# EAGLE design spi-breakout-v01 (EAGLE 7.7.0)
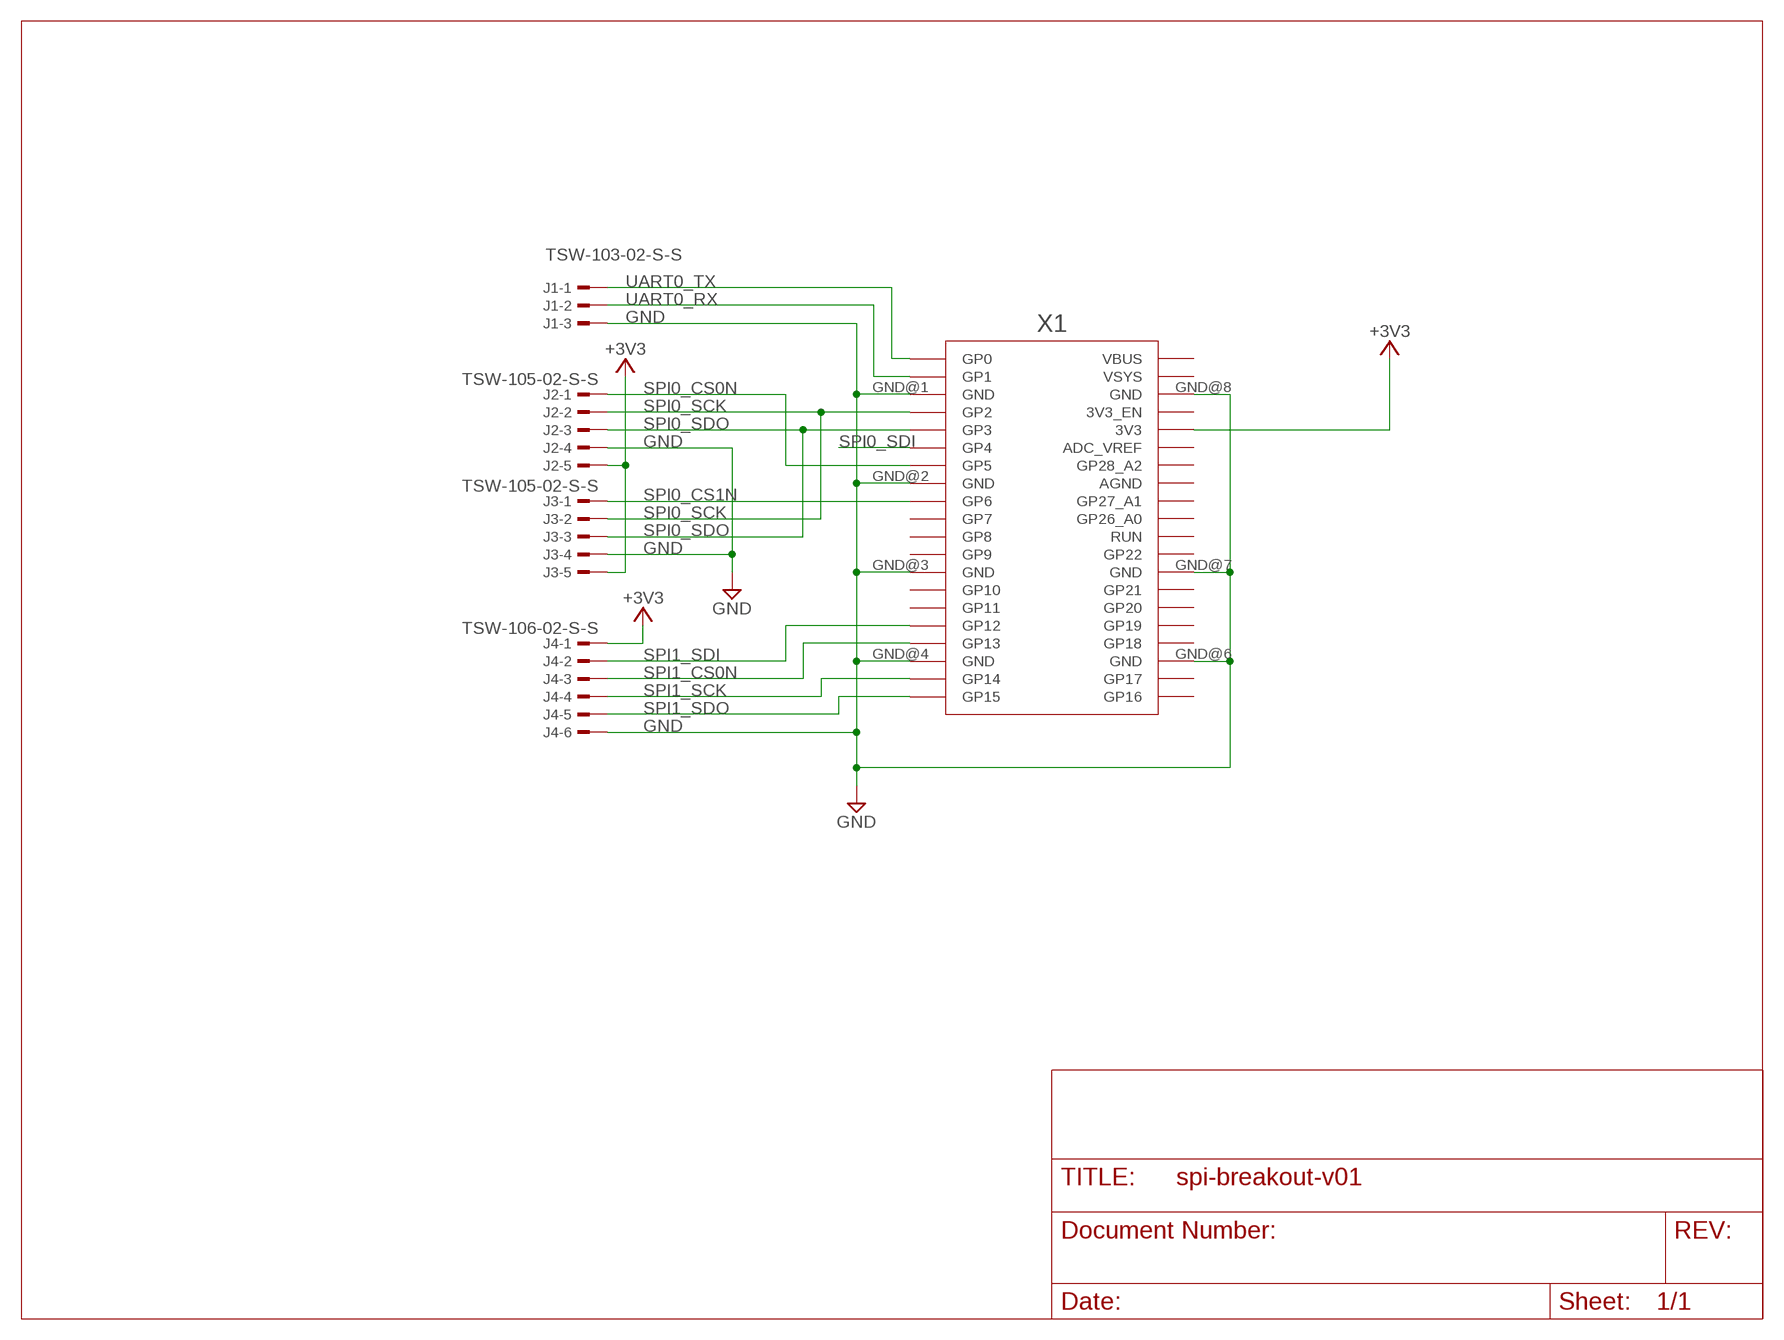
[diagram p0: schematic, sheet 1]

## Parts
J1  TSW-103-02-S-S  [TSW-103-02-S-S]
J2  TSW-105-02-S-S  [TSW-105-02-S-S]
J3  TSW-105-02-S-S  [TSW-105-02-S-S]
J4  TSW-106-02-S-S  [TSW-106-02-S-S]
X1  RPI_PICO_IG-TH  [RPI_PICO_TH]

## Nets
+3V3: J2.5 J3.5 J4.1 X1.3V3
GND: J1.3 J2.4 J3.4 J4.6 X1.GND@1(GND) X1.GND@2(GND) X1.GND@3(GND) X1.GND@4(GND) X1.GND@6(GND) X1.GND@7(GND) X1.GND@8(GND)
SPI0_CS0N: J2.1 X1.GP5
SPI0_CS1N: J3.1 X1.GP6
SPI0_SCK: J2.2 J3.2 X1.GP2
SPI0_SDI: X1.GP4
SPI0_SDO: J2.3 J3.3 X1.GP3
SPI1_CS0N: J4.3 X1.GP13
SPI1_SCK: J4.4 X1.GP14
SPI1_SDI: J4.2 X1.GP12
SPI1_SDO: J4.5 X1.GP15
UART0_RX: J1.2 X1.GP1
UART0_TX: J1.1 X1.GP0
Unconnected: X1.3V3_EN X1.ADC_VREF X1.AGND X1.GP7 X1.GP8 X1.GP9 X1.GP10 X1.GP11 X1.GP16 X1.GP17 X1.GP18 X1.GP19 X1.GP20 X1.GP21 X1.GP22 X1.GP26_A0 X1.GP27_A1 X1.GP28_A2 X1.RUN X1.VBUS X1.VSYS

## Library data of the parts
J1 = con-samtec:TSW-103-02-S-S: THROUGH-HOLE .025" SQ POST HEADER Source: Samtec TSW.pdf; OC_FARNELL: unknown; OC_NEWARK: unknown
J2 J3 = con-samtec:TSW-105-02-S-S: THROUGH-HOLE .025" SQ POST HEADER Source: Samtec TSW.pdf; OC_FARNELL: unknown; OC_NEWARK: unknown
J4 = con-samtec:TSW-106-02-S-S: THROUGH-HOLE .025" SQ POST HEADER Source: Samtec TSW.pdf; OC_FARNELL: unknown; OC_NEWARK: unknown
X1 = RaspberryPi_Pico:RPI_PICO_IG

## Board
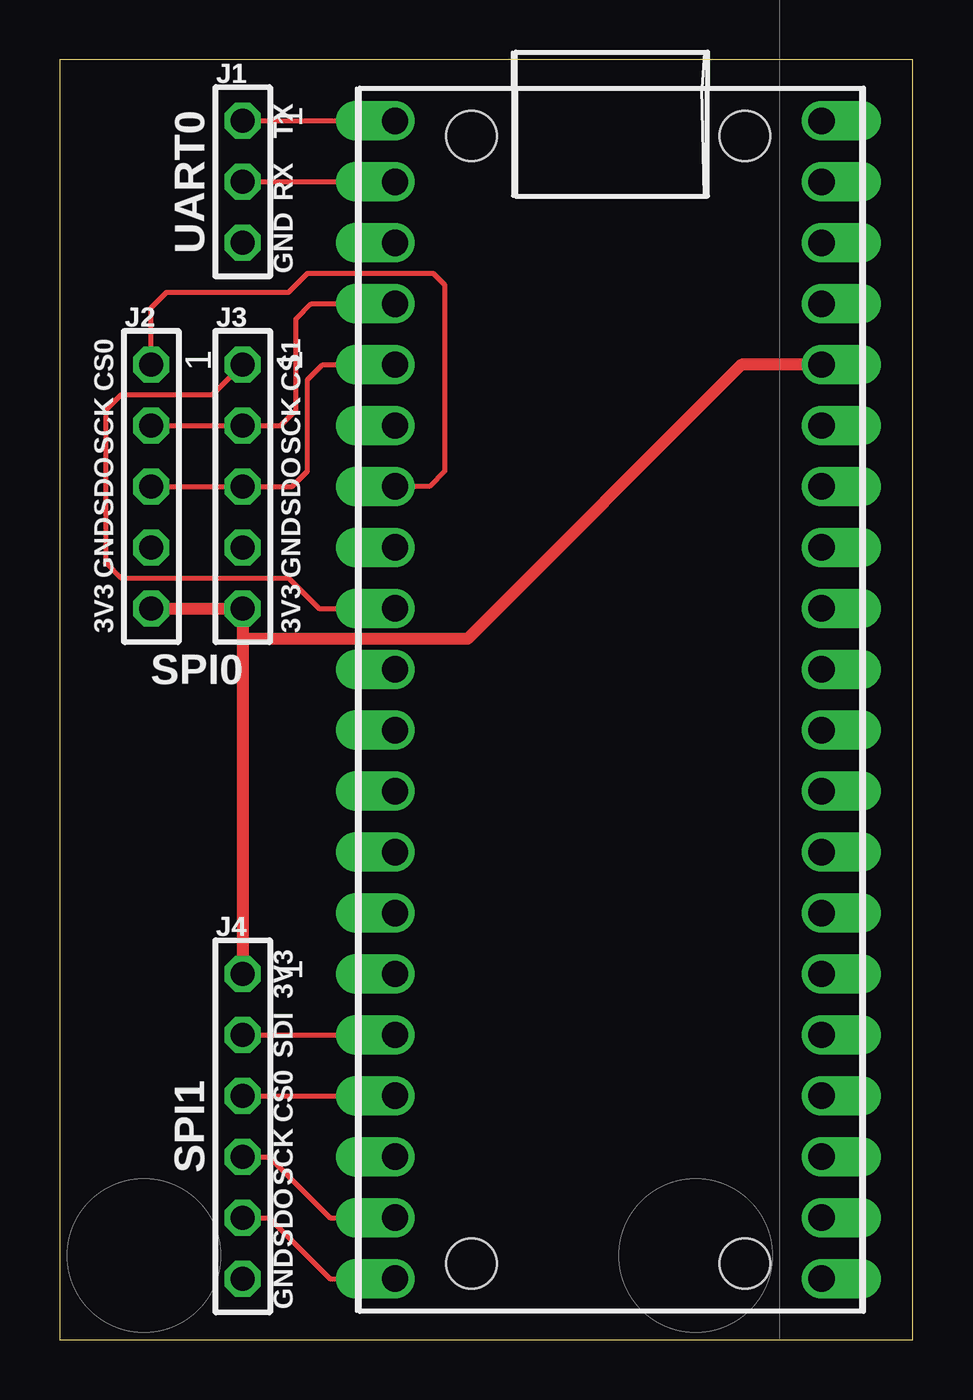
[diagram p1: board, top side]
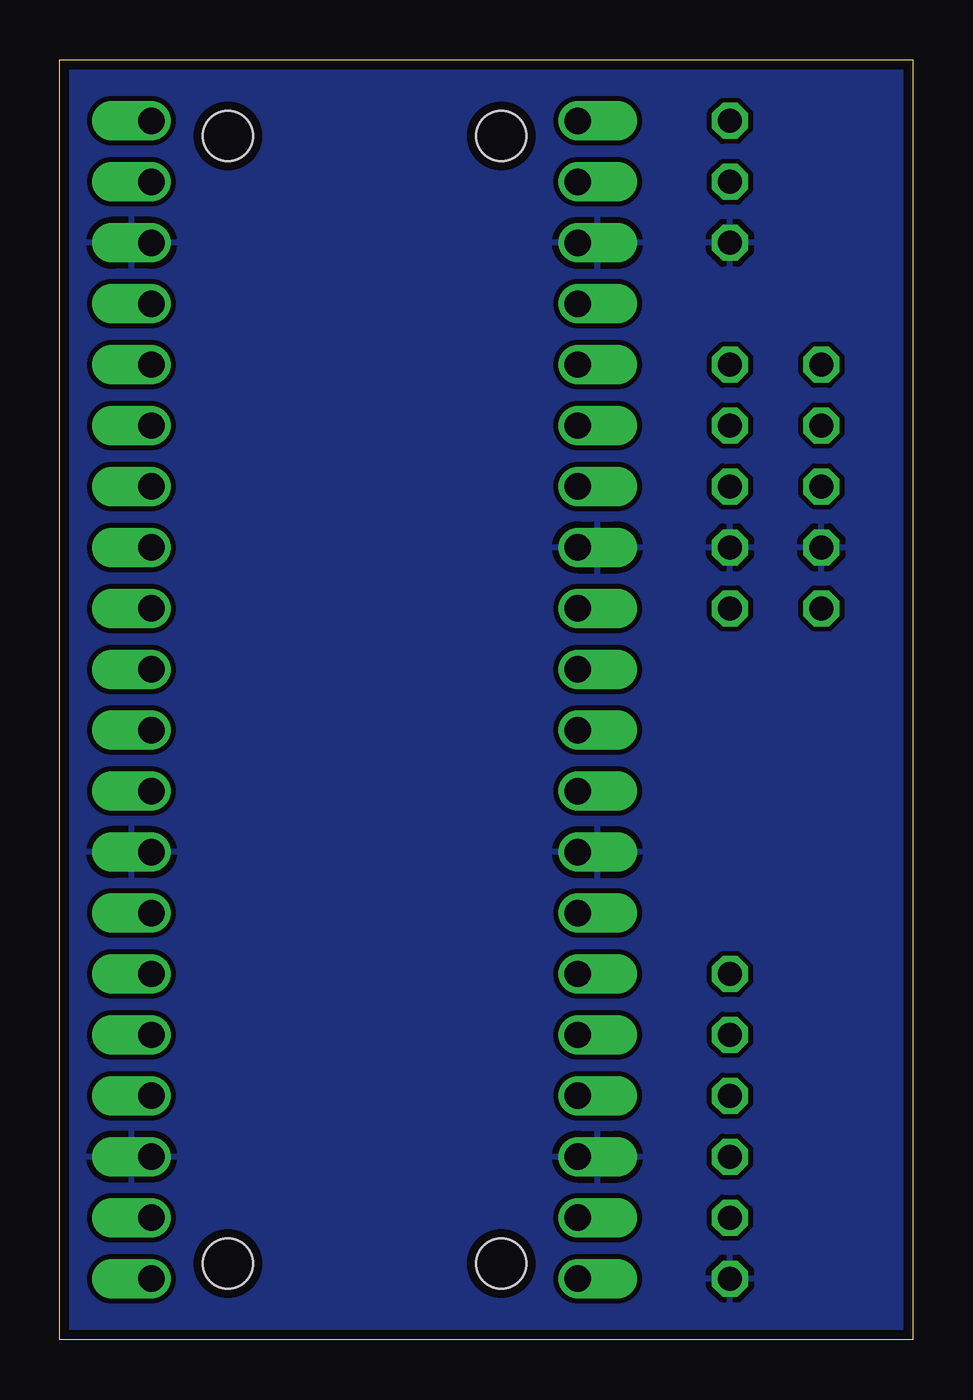
[diagram p2: board, bottom side, seen from below]

Size 35.56 x 53.34 mm. Coordinates in mm from the lower left corner, seen from the top.
Outline: 0,0 35.56,0 35.56,53.34 0,53.34 0,0
Copper layers (1*16): Top 0.035559375mm / dielectric 1.6mm / Bottom 0.035559375mm
Design rules "oshpark-2layer-2018": minimum track width 6mil, minimum drill 10mil, track to track 6mil, track to pad 6mil, pad to pad 6mil, via to via 6mil, smd to smd 6mil, copper to edge 15mil, drill to drill 6mil, minimum pad ring 5mil, minimum via ring 5mil, stop-mask expansion 2.5mil, vias tented up to drill 0mil, thermal gap 10mil

### Footprints (pad centres in the part's own frame; a part is rotated, then mirrored left to right if it is on the bottom)
TSW-103-02-S-S = drill 1 pad 1.5 octagon: 1 2.54,0; 2 0,0; 3 -2.54,0
TSW-105-02-S-S = drill 1 pad 1.5 octagon: 1 5.08,0; 2 2.54,0; 3 0,0; 4 -2.54,0; 5 -5.08,0
TSW-106-02-S-S = drill 1 pad 1.5 octagon: 1 6.35,0; 2 3.81,0; 3 1.27,0; 4 -1.27,0; 5 -3.81,0; 6 -6.35,0
RPI_PICO_TH = drill 1.1 pad 1.6 offset: 3V3 8.89,13.97; 3V3_EN 8.89,16.51; ADC_VREF 8.89,11.43; AGND 8.89,6.35; GND@1 -8.89,19.05; GND@2 -8.89,6.35; GND@3 -8.89,-6.35; GND@4 -8.89,-19.05; GND@6 8.89,-19.05; GND@7 8.89,-6.35; GND@8 8.89,19.05; GP0 -8.89,24.13; GP1 -8.89,21.59; GP2 -8.89,16.51; GP3 -8.89,13.97; GP4 -8.89,11.43; GP5 -8.89,8.89; GP6 -8.89,3.81; GP7 -8.89,1.27; GP8 -8.89,-1.27; GP9 -8.89,-3.81; GP10 -8.89,-8.89; GP11 -8.89,-11.43; GP12 -8.89,-13.97; GP13 -8.89,-16.51; GP14 -8.89,-21.59; GP15 -8.89,-24.13; GP16 8.89,-24.13; GP17 8.89,-21.59; GP18 8.89,-16.51; GP19 8.89,-13.97; GP20 8.89,-11.43; GP21 8.89,-8.89; GP22 8.89,-3.81; GP26_A0 8.89,1.27; GP27_A1 8.89,3.81; GP28_A2 8.89,8.89; RUN 8.89,-1.27; VBUS 8.89,24.13; VSYS 8.89,21.59 | hole 2.1: -5.7,23.5; 5.7,23.5; -5.7,-23.5; 5.7,-23.5

### Placement (x,y rotation side)
J1  7.62,48.26 90 top
J2  3.81,35.56 90 top
J3  7.62,35.56 90 top
J4  7.62,8.89 90 top
X1  22.86,26.67 0 top

### Tracks (layer width: path | path; a pad name or v marks a point on that pad's centre or on a via)
+3V3
  Top 0.406: 7.78,29.21 7.62,29.05
  Top 0.508: J2.5 J3.5 7.62,29.05 J4.1 | X1.3V3 28.42,40.64 16.99,29.21 7.78,29.21
GND
  pour Bottom (isolate 0.203): 0,0 35.56,0 35.56,53.34 0,53.34
SPI0_CS0N
  Top 0.203: J2.1 3.81,43.02 4.45,43.66 9.53,43.66 10.32,44.45 15.56,44.45 16.03,43.97 16.03,36.2 15.4,35.56 X1.GP5
SPI0_CS1N
  Top 0.203: J3.1 6.35,39.37 2.54,39.37 1.91,38.73 1.91,32.38 2.54,31.75 9.53,31.75 10.79,30.48 X1.GP6
SPI0_SCK
  Top 0.203: J2.2 J3.2 9.21,38.1 9.84,38.73 9.84,42.55 10.48,43.18 X1.GP2
SPI0_SDO
  Top 0.203: J2.3 J3.3 9.68,35.56 10.32,36.2 10.32,40.01 10.95,40.64 X1.GP3
SPI1_CS0N
  Top 0.203: J4.3 X1.GP13
SPI1_SCK
  Top 0.203: X1.GP14 11.25,5.08 8.71,7.62 J4.4
SPI1_SDI
  Top 0.203: J4.2 X1.GP12
SPI1_SDO
  Top 0.203: X1.GP15 11.25,2.54 8.71,5.08 J4.5
UART0_RX
  Top 0.203: J1.2 X1.GP1
UART0_TX
  Top 0.203: J1.1 X1.GP0

### Text on the board
tDocu: TX | RX | -
_tsilk: J1 | TX | UART0 | RX | GND | J2 | J3 | CS0 | CS1 | SCK | SCK | SDO | SDO | GND | GND | 3V3 | 3V3 | SPI0 | J4 | 3V3 | SDI | CS0 | SPI1 | SCK | SDO | GND